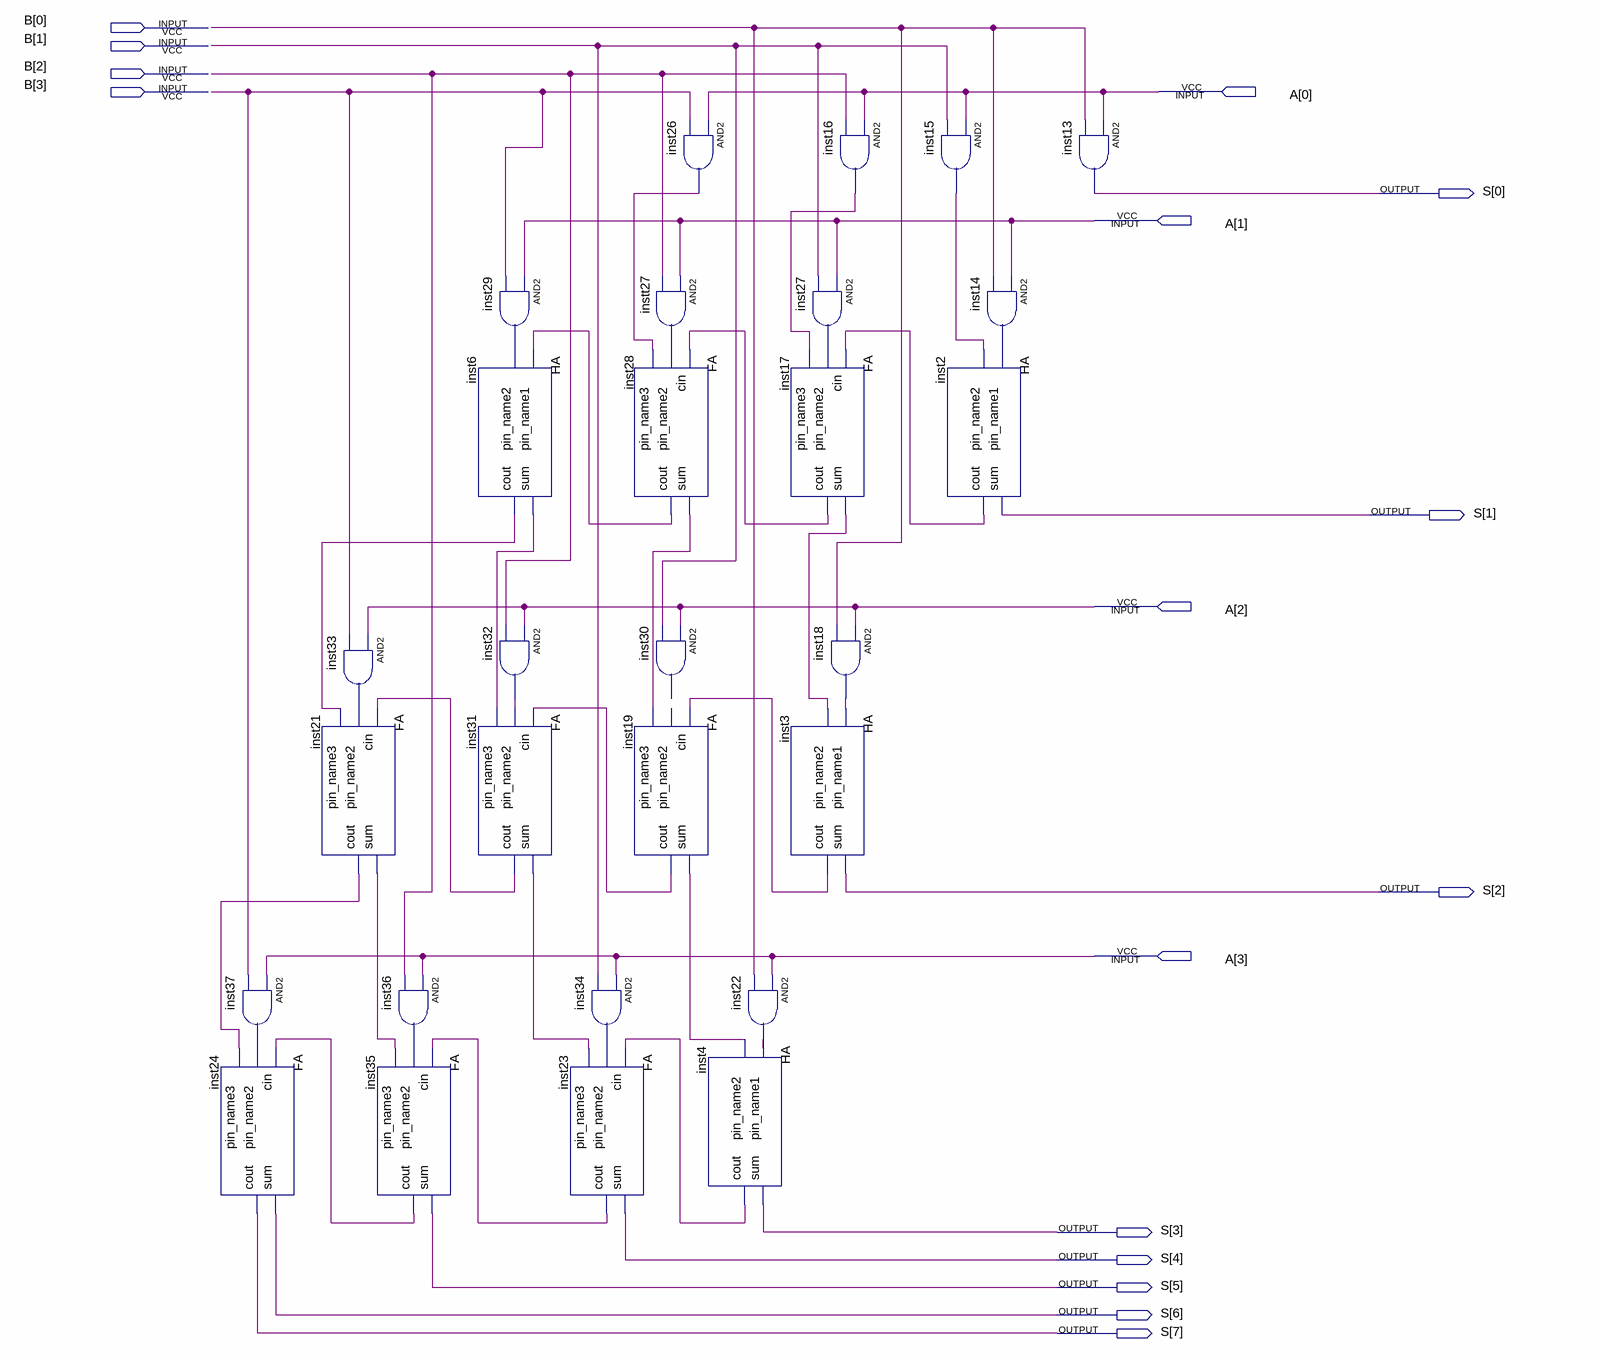
[diagram p0: schematic sheet]
// Quartus schematic multiplier.bdf as structural Verilog: 28 symbols, 16 pins
module multiplier (
  input  [3:0] B,
  input  [3:0] A,
  output [7:0] S
);

  wire inst2_cout, inst3_cout, inst4_cout, inst6_cout, inst6_sum, inst14_out, inst15_out, inst16_out,
       inst17_cout, inst17_sum, inst18_out, inst19_cout, inst19_sum, inst21_cout, inst21_sum, inst22_out,
       inst23_cout, inst26_out, inst27_out, inst28_cout, inst28_sum, inst29_out, inst31_cout, inst31_sum,
       inst32_out, inst33_out, inst34_out, inst35_cout, inst36_out, inst37_out, instt27_out;

  FA inst24 (.cin(inst35_cout), .pin_name2(inst37_out), .pin_name3(inst21_cout), .sum(S[6]), .cout(S[7]));
  and inst37 (inst37_out, A[3], B[3]);
  and inst33 (inst33_out, A[2], B[3]);
  FA inst21 (.cin(inst31_cout), .pin_name2(inst33_out), .pin_name3(inst6_cout), .sum(inst21_sum), .cout(inst21_cout));
  and inst36 (inst36_out, A[3], B[2]);
  FA inst35 (.cin(inst23_cout), .pin_name2(inst36_out), .pin_name3(inst21_sum), .sum(S[5]), .cout(inst35_cout));
  and inst29 (inst29_out, A[1], B[3]);
  HA inst6 (.pin_name1(inst28_cout), .pin_name2(inst29_out), .sum(inst6_sum), .cout(inst6_cout));
  and inst32 (inst32_out, A[2], B[2]);
  FA inst31 (.cin(inst19_cout), .pin_name2(inst32_out), .pin_name3(inst6_sum), .sum(inst31_sum), .cout(inst31_cout));
  FA inst23 (.cin(inst4_cout), .pin_name2(inst34_out), .pin_name3(inst31_sum), .sum(S[4]), .cout(inst23_cout));
  and instt27 (instt27_out, A[1], B[2]);
  FA inst28 (.cin(inst17_cout), .pin_name2(instt27_out), .pin_name3(inst26_out), .sum(inst28_sum), .cout(inst28_cout));
  // AND2 inst30 has open pins: IN1=A[2], IN2=B[1], OUT=open
  FA inst19 (.cin(inst3_cout), .pin_name3(inst28_sum), .sum(inst19_sum), .cout(inst19_cout));  // open: pin_name2
  and inst34 (inst34_out, A[3], B[1]);
  and inst26 (inst26_out, A[0], B[3]);
  HA inst4 (.pin_name1(inst22_out), .pin_name2(inst19_sum), .sum(S[3]), .cout(inst4_cout));
  FA inst17 (.cin(inst2_cout), .pin_name2(inst27_out), .pin_name3(inst16_out), .sum(inst17_sum), .cout(inst17_cout));
  HA inst3 (.pin_name1(inst18_out), .pin_name2(inst17_sum), .sum(S[2]), .cout(inst3_cout));
  and inst22 (inst22_out, A[3], B[0]);
  and inst16 (inst16_out, A[0], B[2]);
  and inst27 (inst27_out, A[1], B[1]);
  and inst18 (inst18_out, A[2], B[0]);
  and inst15 (inst15_out, A[0], B[1]);
  HA inst2 (.pin_name1(inst14_out), .pin_name2(inst15_out), .sum(S[1]), .cout(inst2_cout));
  and inst14 (inst14_out, A[1], B[0]);
  and inst13 (S[0], A[0], B[0]);
endmodule
